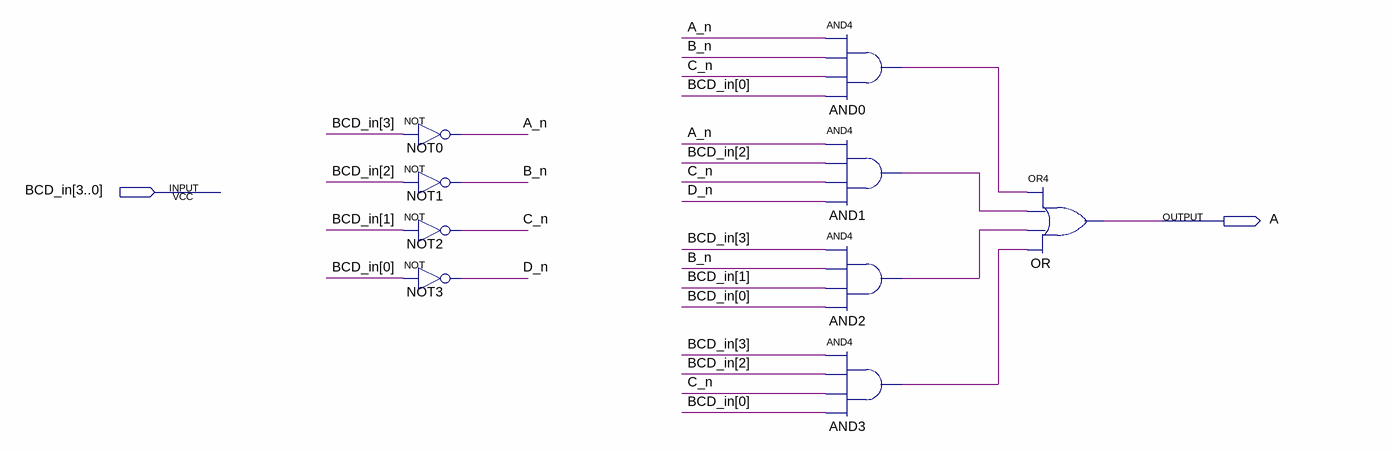
[diagram p0: schematic sheet]
// Quartus schematic DECOD_BCD_A.bdf as structural Verilog: 9 symbols, 2 pins
module DECOD_BCD_A (
  input  [3:0] BCD_in,
  output A
);

  wire A_n, AND0_out, AND1_out, AND2_out, AND3_out, B_n, C_n, D_n;

  not NOT0 (A_n, BCD_in[3]);
  not NOT1 (B_n, BCD_in[2]);
  not NOT2 (C_n, BCD_in[1]);
  not NOT3 (D_n, BCD_in[0]);
  and AND0 (AND0_out, A_n, B_n, C_n, BCD_in[0]);
  and AND1 (AND1_out, A_n, BCD_in[2], C_n, D_n);
  and AND2 (AND2_out, BCD_in[3], B_n, BCD_in[1], BCD_in[0]);
  and AND3 (AND3_out, BCD_in[3], BCD_in[2], C_n, BCD_in[0]);
  or OR (A, AND0_out, AND1_out, AND2_out, AND3_out);
endmodule
